# Altium schematic sheet team throttle control.SchDoc
size 160 x 226 mm; Origin: Eagle
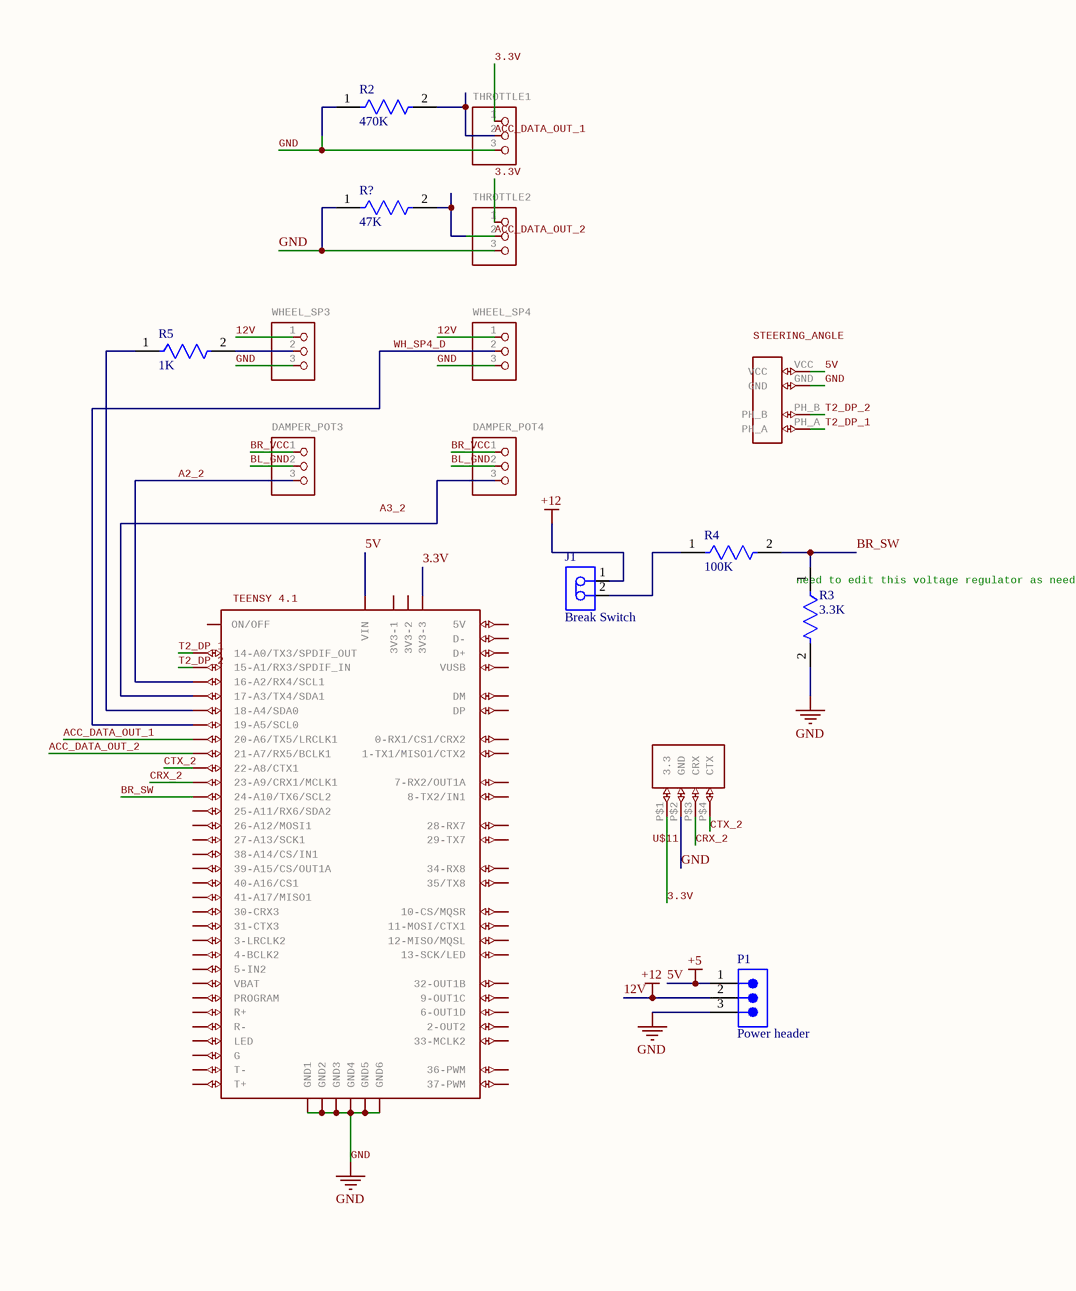
[diagram p0: team throttle control.SchDoc]

## Parts
DAMPER_POT3  (no value)  [1X03-CLEANBIG]
DAMPER_POT4  (no value)  [1X03-CLEANBIG]
J1  Break Switch  [JST-B2B-PH-K-S_V]
P1  Power header  [61300311121]
R2  470K  [FP-MRS25-MFG]
R3  3.3K  [FP-MRS25-MFG]
R4  100K  [FP-MRS25-MFG]
R5  1K  [FP-MRS25-MFG]
R?  47K  [FP-MRS25-MFG]
STEERING_ANGLE  (no value)  [ROTARY_ENCODER]
THROTTLE1  (no value)  [1X03]
THROTTLE2  (no value)  [1X03]
U$3  TEENSY4.1: TEENSY 4.1  [TEENSY41]
U$11  (no value)  [CAN_TEN]
WHEEL_SP3  (no value)  [1X03]
WHEEL_SP4  (no value)  [1X03]

## Nets
5V: P1.1 STEERING_ANGLE.VCC U$3.VIN  [also labelled +5]
12V: J1.1 P1.2 WHEEL_SP3.1 WHEEL_SP4.1  [also labelled +12]
GND: P1.3 R2.1 R3.2 R?.1 STEERING_ANGLE.GND THROTTLE1.3 THROTTLE2.3 U$3.GND1 U$3.GND2 U$3.GND3 U$3.GND4 U$3.GND5 U$3.GND6 U$11.P$2(GND) WHEEL_SP3.3 WHEEL_SP4.3
3.3V: THROTTLE1.1 THROTTLE2.1 U$3.3V3-3 U$11.P$1(3.3)
A2_2: DAMPER_POT3.3 U$3.16-A2/RX4/SCL1
ACC_DATA_OUT_1: R2.2 THROTTLE1.2 U$3.20-A6/TX5/LRCLK1
ACC_DATA_OUT_2: R?.2 THROTTLE2.2 U$3.21-A7/RX5/BCLK1
BL_GND: DAMPER_POT3.2 DAMPER_POT4.2
BR_SW: R3.1 R4.2 U$3.24-A10/TX6/SCL2
BR_VCC: DAMPER_POT3.1 DAMPER_POT4.1
CRX_2: U$3.23-A9/CRX1/MCLK1 U$11.P$3(CRX)
CTX_2: U$3.22-A8/CTX1 U$11.P$4(CTX)
T2_DP_1: STEERING_ANGLE.PH_A U$3.14-A0/TX3/SPDIF_OUT
T2_DP_2: STEERING_ANGLE.PH_B U$3.15-A1/RX3/SPDIF_IN
WH_SP4_D: U$3.19-A5/SCL0 WHEEL_SP4.2
NetDAMPER_POT4_3: DAMPER_POT4.3 U$3.17-A3/TX4/SDA1
NetJ1_2: J1.2 R4.1
NetR5_1: R5.1 U$3.18-A4/SDA0
NetR5_2: R5.2 WHEEL_SP3.2

Not connected (* = marked no-connect by the designer): U$3 0-RX1/CS1/CRX2 1-TX1/MISO1/CTX2 2-OUT2 3-LRCLK2 3V3-1 3V3-2 4-BCLK2 5-IN2 6-OUT1D 7-RX2/OUT1A 8-TX2/IN2(8-TX2/IN1) 9-OUT1C 10-CS\MQSR(10-CS/MQSR) 11-MOSI/CTX1 12-MISO/MQSL 13-SCK/LED 25-A11/RX6/SDA2 26-A12/MOSI1 27-A13/SCK1 28-RX7 29-TX7 30-CRX3 31-CTX3 32-OUT1B 33-MCLK2 34-RX8 35-TX8(35/TX8) 36-PWM 37-PWM 38-A14/CS/IN1 39-A15/CS/OUT1A 40-A16/CS1 41-A17/MISO1 +5V(5V) D+ D- DM DP G LED ON/OFF PROGRAM R+ R- T+ T- VBAT VUSB

## Notes on the sheet
- (near R3) need to edit this voltage regulator as needed
- Labels drawn without touching a wire or pin: A3_2

## Library data of the parts
DAMPER_POT3 DAMPER_POT4 = PINHD-1X3CB: PIN HEADER; GateName_1: A; SymbolName_1: PINHD3; DeviceName: CB; LibraryName: adafruit; DeviceSetName: PINHD-1X3
J1 = CMP-2000-05162-1: Male Header, Pitch 2 mm, 1 x 2 Position, Height 6 mm, Tail Length 3.4 mm, -25 to 85 degC, RoHS, Bulk; Manufacturer: JST; Pitch: 2mm; Style/Orientation: StraightHeader/Plug; No of Positions: 2; Datasheet Version: Nov-08; Datasheet URL: http://datasheet.octopart.com/B2B-PH-K-S%28LF%29%28SN%29-JST-datasheet-8324864.pdf; Manufacturer URL: http://www.jst.com/home2.html; Type: ShroudedHeader; Termination: Crimp
P1 = CMP-1502-01062-2: NexarPartId: 32855521; Voltage Rating: 250V; Current Rating: 3A; Connector Type: Male Pin; Number of Positions: 3; Gender: Male; Contact Resistance: 20mΩ; Pitch: 2.54mm; Max Operating Temperature: 105°C; Lead Pitch: 2.54mm; Lead Free: Lead Free; Contact Mating Length: 5.9944mm; Contact Material: Copper; Number of Pins: 3; Orientation: Vertical; Height: 8.94mm; Packaging: Bulk; Min Operating Temperature: -40°C; Mount: Through Hole; RoHS: Compliant; Number of Contacts: 3; Operating Supply Voltage: 250V; Termination: Solder; Number of Rows: 1; Contact Plating: Gold; Color: Black; REACH SVHC: Unknown
R2-R5 R? = CMP-00030-42757237-1: MRS25000C1000FRP00 Resistor, 100 Ohm, ± 1%, 600 mW, Axial Leaded, Metal Film (Thin Film), Professional; Max Power Dissipation: 600mW; Resistance: 100Ω; Voltage Rating: 350V; Temperature Coefficient: 50ppm/°C; Lead Diameter: 600µm; RoHS: Compliant; Radiation Hardening: No; Schedule B: 8533210090, 8533210090; Length: 6.5mm; Packaging: Tape & Reel (TR); Number of Terminations: 2; Mount: Through Hole; Width: 2.5mm; Tolerance: 1%; Military Standard: Not; Voltage Rating (DC): 350V; Contact Plating: Tin; Number of Pins: 2; Max Operating Temperature: 155°C; NexarPartId: 42757237; Diameter: 2.5mm; Composition: Metal Film, Thin Film; REACH SVHC: Unknown; Power Rating: 600mW; Lead Free: Lead Free; Termination: Axial; Case/Package: Axial; Min Operating Temperature: -55°C
STEERING_ANGLE = ROTARY_ENCODER: GateName_1: G$1; SymbolName_1: ROTARY_ENCODER; LibraryName: F-E library custom components; DeviceSetName: ROTARY_ENCODER
THROTTLE1 THROTTLE2 WHEEL_SP3 WHEEL_SP4 = PINHD-1X3: PIN HEADER; GateName_1: A; SymbolName_1: PINHD3; LibraryName: adafruit; DeviceSetName: PINHD-1X3
U$3 = TEENSY41: GateName_1: G$1; SymbolName_1: TEENSY41; LibraryName: teensy; DeviceSetName: TEENSY41
U$11 = CAN_TEE: GateName_1: G$1; SymbolName_1: CAN_TEN; LibraryName: F-E library custom components; DeviceSetName: CAN_TEE